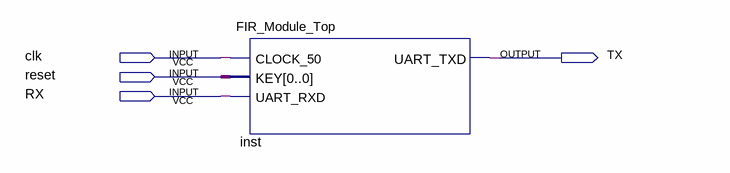
[diagram p0: schematic sheet]
// Quartus schematic FIR_Module_Test.bdf as structural Verilog: 1 symbols, 4 pins
module FIR_Module_Test (
  input  clk,
  input  reset,
  input  RX,
  output TX
);

  FIR_Module_Top inst (.CLOCK_50(clk), .KEY(reset), .UART_RXD(RX), .UART_TXD(TX));
endmodule
